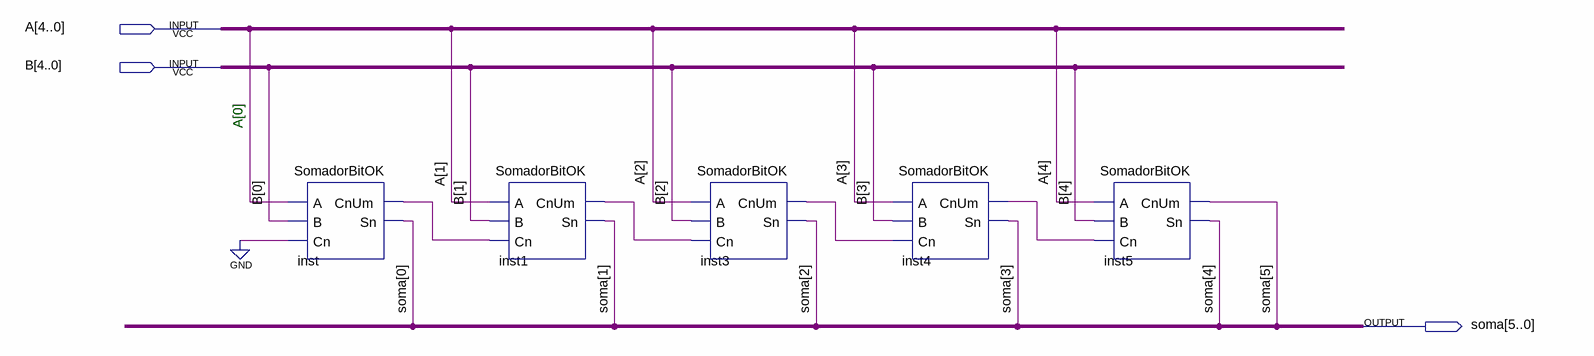
[diagram p0: schematic sheet]
// Quartus schematic somadorOK.bdf as structural Verilog: 5 symbols, 3 pins
module somadorOK (
  input  [4:0] A,
  input  [4:0] B,
  output [5:0] soma
);

  wire inst1_cnum, inst3_cnum, inst4_cnum, inst_cnum;

  SomadorBitOK inst (.A(A[0]), .B(B[0]), .Cn(1'b0), .CnUm(inst_cnum), .Sn(soma[0]));
  SomadorBitOK inst1 (.A(A[1]), .B(B[1]), .Cn(inst_cnum), .CnUm(inst1_cnum), .Sn(soma[1]));
  SomadorBitOK inst3 (.A(A[2]), .B(B[2]), .Cn(inst1_cnum), .CnUm(inst3_cnum), .Sn(soma[2]));
  SomadorBitOK inst4 (.A(A[3]), .B(B[3]), .Cn(inst3_cnum), .CnUm(inst4_cnum), .Sn(soma[3]));
  SomadorBitOK inst5 (.A(A[4]), .B(B[4]), .Cn(inst4_cnum), .CnUm(soma[5]), .Sn(soma[4]));

  // Notes on the sheet:
  //   A[0]
endmodule
